# Altium schematic sheet 03_LTC6820.SchDoc: foxBMS BMS-Interface
size A3; DocumentNumber: 3; SheetNumber: 3; SheetTotal: 6; Author: Fraunhofer IISB foxBMS Team; REL-DATE: 2017-05-09; VERSION: 1.1.0; GateName_1: G$1; SymbolName_1: FRAME_B_L; LibraryName: foxBMS_BMS-Master_V1.00_A; DeviceSetName: FRAME_B_L; GateName_2: G$2; SymbolName_2: DOCFIELD; SheetDescription: Two LTC6820 for forward and reverese isoSPI
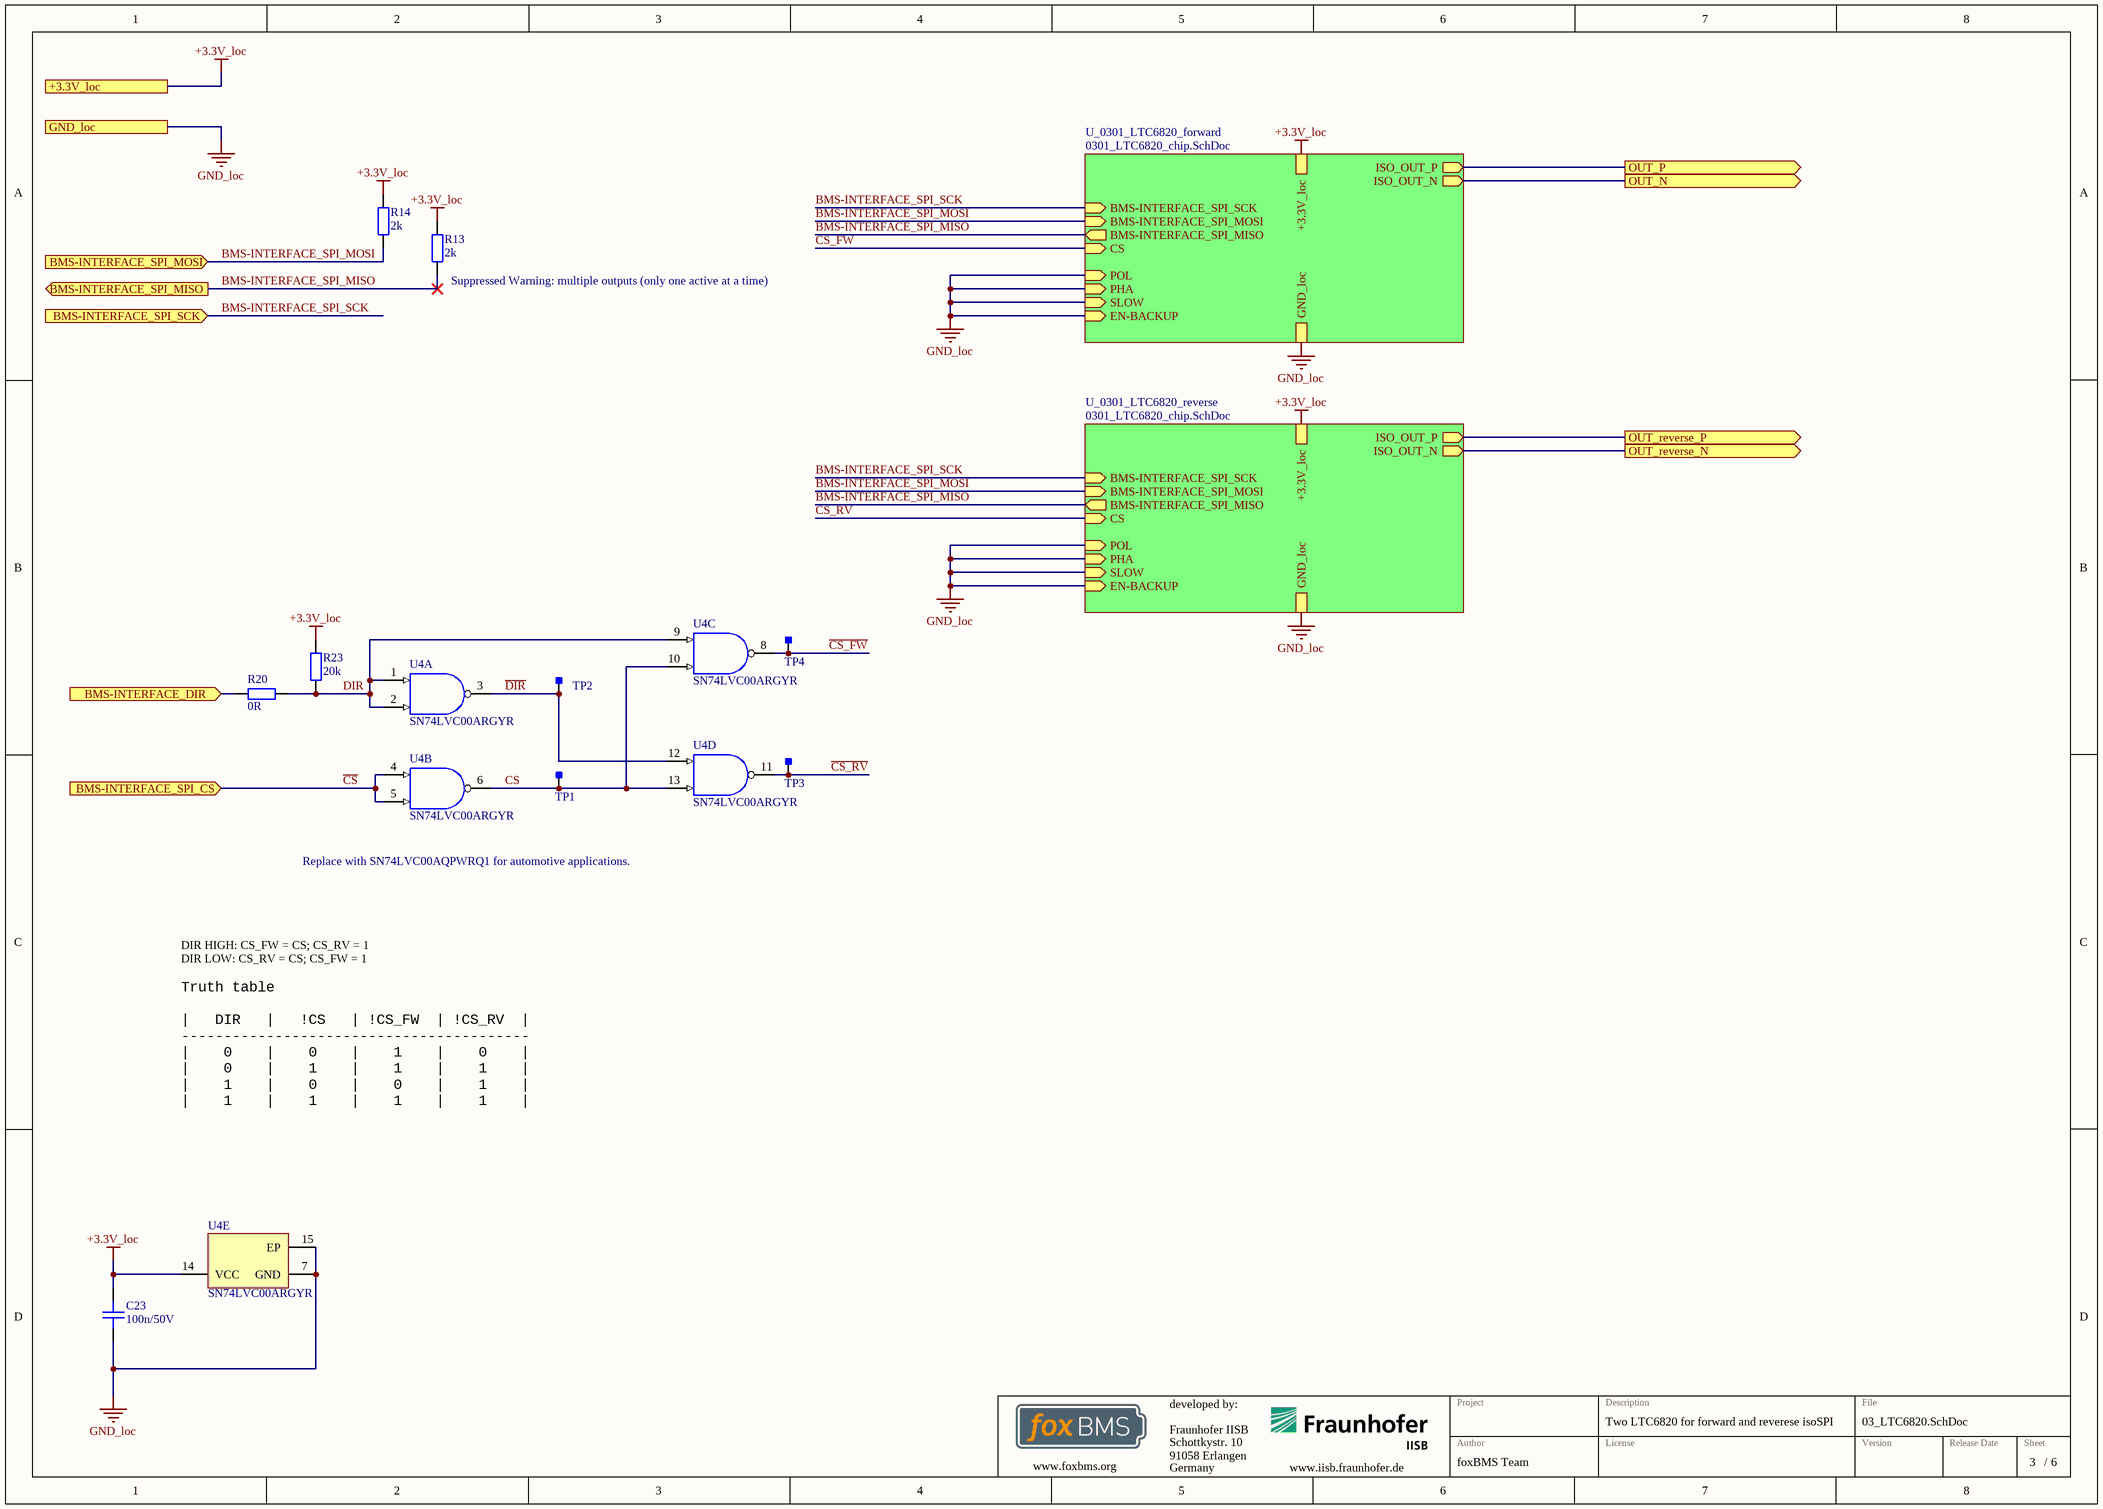
[diagram p0: 03_LTC6820.SchDoc]

## Parts
C23  100n/50V  [0603C]
R13  2k  [0603R]
R14  2k  [0603R]
R20  0R  [0603R]
R23  20k  [0603R]
TP1  CS  [Testpoint_S1]  (value not drawn)  (no BOM)
TP2  DIR  [Testpoint_S1]  (value not drawn)  (no BOM)
TP3  CS_RV  [Testpoint_S1]  (value not drawn)  (no BOM)
TP4  CS_FW  [Testpoint_S1]  (value not drawn)  (no BOM)
U4  SN74LVC00ARGYR  [RGY0014A_V]  (parts A,B,C,D,E of 5)

## Sub-sheets
U_0301_LTC6820_forward = 0301_LTC6820_chip.SchDoc: ISO_OUT_P (out), ISO_OUT_N (out), +3.3V_loc, GND_loc, BMS-INTERFACE_SPI_MISO (out), BMS-INTERFACE_SPI_SCK (in), BMS-INTERFACE_SPI_MOSI (in), POL (in), PHA (in), SLOW (in), EN-BACKUP (in), CS (in)
U_0301_LTC6820_reverse = 0301_LTC6820_chip.SchDoc: ISO_OUT_P (out), ISO_OUT_N (out), +3.3V_loc, GND_loc, BMS-INTERFACE_SPI_MISO (out), BMS-INTERFACE_SPI_SCK (in), BMS-INTERFACE_SPI_MOSI (in), POL (in), PHA (in), SLOW (in), EN-BACKUP (in), CS (in)

## Ports
+3.3V_loc, BMS-INTERFACE_DIR (in), BMS-INTERFACE_SPI_CS (in), BMS-INTERFACE_SPI_MISO (out), BMS-INTERFACE_SPI_MOSI (in), BMS-INTERFACE_SPI_SCK (in), GND_loc, OUT_N (out), OUT_P (out), OUT_reverse_N (out), OUT_reverse_P (out)

## Nets
+3.3V_loc: C23.2 R13.2 R14.2 R23.2 U4.14(VCC) ; port +3.3V_loc, sheet U_0301_LTC6820_forward/+3.3V_loc, sheet U_0301_LTC6820_reverse/+3.3V_loc
GND_loc: C23.1 U4.7(GND) U4.15(EP) ; port GND_loc, sheet U_0301_LTC6820_forward/GND_loc, sheet U_0301_LTC6820_forward/POL, sheet U_0301_LTC6820_forward/PHA, sheet U_0301_LTC6820_forward/SLOW, sheet U_0301_LTC6820_forward/EN-BACKUP, sheet U_0301_LTC6820_reverse/GND_loc, sheet U_0301_LTC6820_reverse/POL, sheet U_0301_LTC6820_reverse/PHA, sheet U_0301_LTC6820_reverse/SLOW, sheet U_0301_LTC6820_reverse/EN-BACKUP
BMS-INTERFACE_DIR: R20.1 ; port BMS-INTERFACE_DIR
BMS-INTERFACE_SPI_MISO: R13.1 ; port BMS-INTERFACE_SPI_MISO, sheet U_0301_LTC6820_forward/BMS-INTERFACE_SPI_MISO, sheet U_0301_LTC6820_reverse/BMS-INTERFACE_SPI_MISO
BMS-INTERFACE_SPI_MOSI: R14.1 ; port BMS-INTERFACE_SPI_MOSI, sheet U_0301_LTC6820_forward/BMS-INTERFACE_SPI_MOSI, sheet U_0301_LTC6820_reverse/BMS-INTERFACE_SPI_MOSI
BMS-INTERFACE_SPI_SCK: port BMS-INTERFACE_SPI_SCK, sheet U_0301_LTC6820_forward/BMS-INTERFACE_SPI_SCK, sheet U_0301_LTC6820_reverse/BMS-INTERFACE_SPI_SCK
~{CS}: U4.4(2A) U4.5(2B) ; port BMS-INTERFACE_SPI_CS
~{CS_FW}: TP4.1 U4.8(3Y) ; sheet U_0301_LTC6820_forward/CS
~{CS_RV}: TP3.1 U4.11(4Y) ; sheet U_0301_LTC6820_reverse/CS
CS: TP1.1 U4.6(2Y) U4.10(3B) U4.13(4B)
~{DIR}: TP2.1 U4.3(1Y) U4.12(4A)
DIR: R20.2 R23.1 U4.1(1A) U4.2(1B) U4.9(3A)
OUT_N: port OUT_N, sheet U_0301_LTC6820_forward/ISO_OUT_N
OUT_P: port OUT_P, sheet U_0301_LTC6820_forward/ISO_OUT_P
OUT_reverse_N: port OUT_reverse_N, sheet U_0301_LTC6820_reverse/ISO_OUT_N
OUT_reverse_P: port OUT_reverse_P, sheet U_0301_LTC6820_reverse/ISO_OUT_P

## Notes on the sheet
- (near R13) Suppressed Warning: multiple outputs (only one active at a time)
- Replace with SN74LVC00AQPWRQ1 for automotive applications.
- DIR HIGH: CS_FW = CS; CS_RV = 1
  DIR LOW: CS_RV = CS; CS_FW = 1
- Truth table
  |   DIR   |   !CS   | !CS_FW  | !CS_RV  |
  -----------------------------------------
  |    0    |    0    |    1    |    0    |
  |    0    |    1    |    1    |    1    |
  |    1    |    0    |    0    |    1    |
  |    1    |    1    |    1    |    1    |
- Fraunhofer IISB
- Schottkystr. 10
- developed by:
- 91058 Erlangen
- Germany
- Author
- Project
- License
- Description
- File
- Version
- Release Date
- Sheet
- www.foxbms.org
- www.iisb.fraunhofer.de
- foxBMS Team
- /

## Library data of the parts
C23 = gen_C_ceramic_100n_50V_X7R_0603: MLCC; Capacitance: 100n; Rated Voltage: 50V; Dielectric: X7R; Case EIA: 0603; Case Metric: 1608; PnP Package: C_0603_10; PnP Value: 100n/50V/X7R; PnP equipped: x; Automotive Qualified: True; Part Number: gen_C_ceramic_100n_50V_X7R_0603; Supplier 1: Farnell; Supplier Part Number 1: 2525267; Supplier 2: Digikey; Supplier Part Number 2: 490-6049-1-ND; Supplier 3: Farnell; Supplier Part Number 3: 2070398
R13 R14 = gen_R_2k_0603: SMD Resistor 2k 0603; Tolerance: 1%; Power: 0.1W; Case EIA: 0603; Case Metric: 1608; Maximum Working Voltage: 75V; PnP Package: R_0603; Automotive Qualified: True; Part Number: gen_R_2k_0603; Operating Temperature: -55°C - +155°C; Resistance: 2k; Series: E24, E96; PnP Value: 2k; Supplier 1: Farnell; Supplier Part Number 1: 2059343
R20 = gen_R_0R_0603: SMD Resistor 0R 0603; Power: 0.1W; Case EIA: 0603; Case Metric: 1608; Maximum Working Voltage: 75V; PnP Package: R_0603; Automotive Qualified: True; Part Number: gen_R_0R_0603; Operating Temperature: -55°C - +155°C; Resistance: 0R; Series: Jumper; PnP Value: 0R; Supplier 1: Farnell; Supplier Part Number 1: 2616580
R23 = gen_R_20k_0603: SMD Resistor 20k 0603; Tolerance: 1%; Power: 0.1W; Case EIA: 0603; Case Metric: 1608; Maximum Working Voltage: 75V; PnP Package: R_0603; Automotive Qualified: True; Part Number: gen_R_20k_0603; Operating Temperature: -55°C - +155°C; Resistance: 20k; Series: E24, E96; PnP Value: 20k; Supplier 1: Farnell; Supplier Part Number 1: 2059432
TP1-TP4 = Testpoint_Square: Testpoint, square; Part Number: Testpoint_Square
U4 = CMP-1627-00656-3: Quadruple 2-Input Positive-NAND Gate, RGY0014A, LARGE T&R; Manufacturer: Texas Instruments; tpd @ Nom Voltage(Max)(ns): 12.5,6.4,5.1,4.3; Input Type: TTL; Output Drive (IOL/IOH)(Max)(mA): 24/-24; VCC(Max)(V): 3.6; Voltage(Nom)(V): 1.8,2.5,2.7,3.3; VCC(Min)(V): 1.65; ICC @ Nom Voltage(Max)(mA): 0.04; F @ Nom Voltage(Max)(Mhz): 150; Rating: Catalog; Technology Family: LVC; Schmitt Trigger: No; Generic Part Number: SN74LVC00A; PackageReference: RGY0014A; Output Type: TTL; Code_JEDEC: MO-241; Operating Temperature Range(C): -40 to 125; DatasheetVersion: SCAS279Q